# EAGLE design cigpack-batt_lm3622 (EAGLE 4.13)
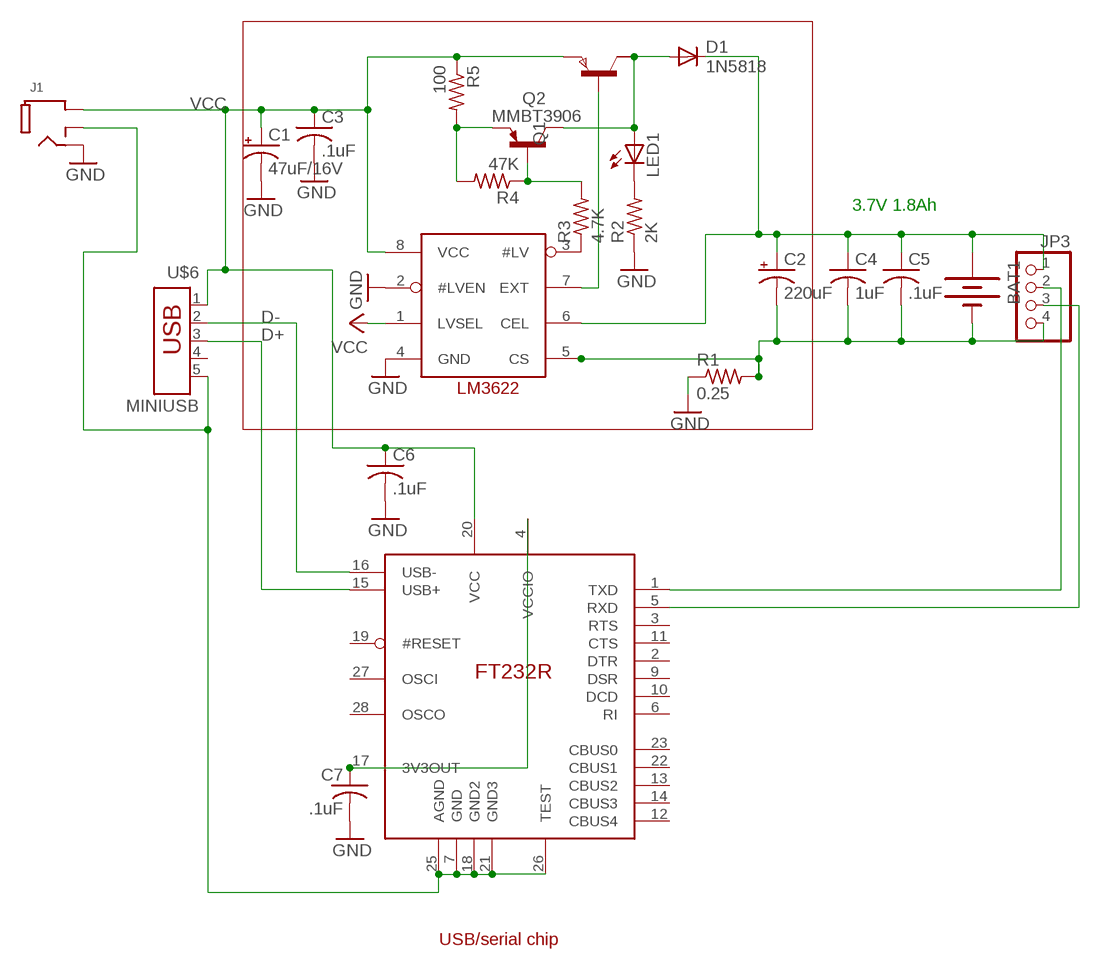
[diagram p0: schematic, sheet 1]

## Parts
BAT1  BATTERY  [LIPOLY-65X34MM]
C1  47uF/16V  CPOL-US153CLV-0605  [153CLV-0605]
C2  220uF  CPOL-US153CLV-0810  [153CLV-0810]
C3  .1uF  C-USC1206  [C1206]
C4  1uF  C-USC3225  [C3225]
C5  .1uF  C-USC1206  [C1206]
C6  .1uF  C-USC1206  [C1206]
C7  .1uF  C-USC1206  [C1206]
D1  1N5818  DIODE-SMB  [SMB]
IC1  LM3622  [SO08]
IC2  FT232R  [TSSOP28]
J1  CLEANAIR_POWERJACK163-2217  [CLEANAIR_5MMJACK]
JP3  PINHD-1X4  [1X04]
LED1  LEDSMT1206  [1206]
Q1  PNPSOT223  [SOT223]
Q2  MMBT3906  MMBT3906LT1SMD  [SOT23-BEC]
R1  0.25  R-US_M1206  [M1206]
R2  2K  R-US_R1206  [R1206]
R3  4.7K  R-US_R1206  [R1206]
R4  47K  R-US_R1206  [R1206]
R5  100  R-US_R1206  [R1206]
U$6  MINIUSB  [UX60A-MB-5SY]

## Nets
D+: IC2.15(USB+) U$6.3
D-: IC2.16(USB-) U$6.2
GND: C1.- C3.2 C6.2 C7.2 IC1.2(#LVEN) IC1.4(GND) J1.RING R1.1 R2.1
N$1: BAT1.- C2.- C4.2 C5.2 IC1.5(CS) JP3.4 R1.2
N$2: IC2.7(GND) IC2.18(GND2) IC2.21(GND3) IC2.25(AGND) IC2.26(TEST) J1.RING_SW U$6.5
N$3: LED1.C R2.2
N$4: IC1.3(#LV) R3.1
N$5: Q2.B R3.2 R4.1
N$6: Q2.E R4.2 R5.2
N$7: D1.A LED1.A Q1.4(C1) Q2.C
N$8: BAT1.+ C2.+ C4.1 C5.1 D1.C IC1.6(CEL) JP3.1
N$9: IC1.7(EXT) Q1.1(B)
N$10: IC2.1(TXD) JP3.2
N$17: C7.1 IC2.4(VCCIO) IC2.17(3V3OUT)
N$41: IC2.5(RXD) JP3.3
VCC: C1.+ C3.1 C6.1 IC1.1(LVSEL) IC1.8(VCC) IC2.20(VCC) J1.TIP Q1.3(E) R5.1 U$6.1
Unconnected: IC2.2(DTR) IC2.3(RTS) IC2.6(RI) IC2.9(DSR) IC2.10(DCD) IC2.11(CTS) IC2.12(CBUS4) IC2.13(CBUS2) IC2.14(CBUS3) IC2.19(#RESET) IC2.22(CBUS1) IC2.23(CBUS0) IC2.27(OSCI) IC2.28(OSCO) Q1.2(C) U$6.4

## Notes on the sheet
- 3.7V 1.8Ah
- USB/serial chip

## Library data of the parts
BAT1 = cleanair:BATTERY: BATTERY
C1 C2 = rcl:CPOL-US: POLARIZED CAPACITOR, American symbol
C3-C7 = rcl:C-US: CAPACITOR, American symbol
D1 = diode:DIODE-: DIODE
IC1 = liion:LM3622
IC2 = ft232:FT232R
J1 = cigpack-batt_lm3622:CLEANAIR_POWERJACK
JP3 = pinhead:PINHD-1X4: PIN HEADER
LED1 = led:LED: LED OSRAM: - CHIPLED LG R971, LG N971, LY N971, LG Q971, LY Q971, LO R971, LY R971 LH N974, LH R974 LS Q976, LO Q976, LY Q976 LO Q996 - Hyper CHIPLED LW Q18S LB Q993, LB Q99A, LB R99A - SideLED LS A670, LO A670, LY A670, LG A670, LP A670 LB A673, LV A673, LT A673, LW A673 LH A674 LY A675 LS A676, LA A676, LO A676, LY A676, LW A676 LS A679, LY A679, LG A679 - Hyper Micro SIDELED® LS Y876, LA Y876, LO Y876, LY Y876 LT Y87S - SmartLED LW L88C, LW L88S LB L89C, LB L89S, LG L890 LS L89K, LO L89K, LY L89K LS L896, LA L896, LO L896, LY L896 - TOPLED LS T670, LO T670, LY T670, LG T670, LP T670 LSG T670, LSP T670, LSY T670, LOP T670, LYG T670 LG T671, LOG T671, LSG T671 LB T673, LV T673, LT T673, LW T673 LH T674 LS T676, LA T676, LO T676, LY T676, LB T676, LH T676, LSB T676, LW T676 LB T67C, LV T67C, LT T67C, LS T67K, LO T67K, LY T67K, LW E67C LS E67B, LA E67B, LO E67B, LY E67B, LB E67C, LV E67C, LT E67C LW T67C LS T679, LY T679, LG T679 LS T770, LO T770, LY T770, LG T770, LP T770 LB T773, LV T773, LT T773, LW T773 LH T774 LS E675, LA E675, LY E675, LS T675 LS T776, LA T776, LO T776, LY T776, LB T776 LHGB T686 LT T68C, LB T68C - Hyper Mini TOPLED® LB M676 - Mini TOPLED Santana® LG M470 LS M47K, LO M47K, LY M47K Source: http://www.osram.convergy.de/
Q1 = zetex:PNPSOT223: PNP TRANSISTOR
Q2 = transistor-pnp:MMBT3906*: PNP Transistror
R1-R5 = rcl:R-US_: RESISTOR, American symbol
U$6 = cleanair:MINIUSB

## Board
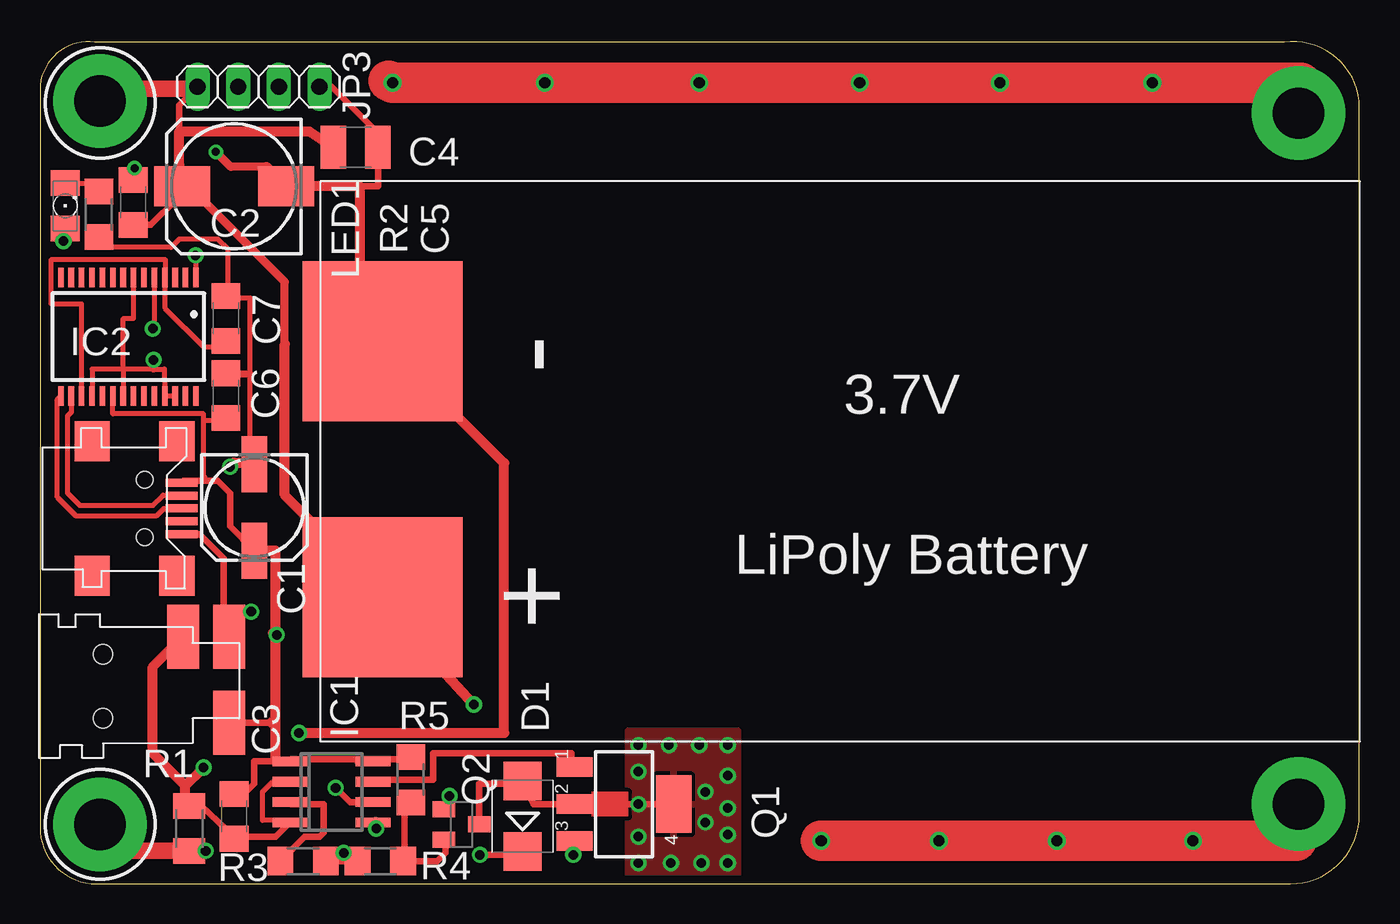
[diagram p1: board, top side]
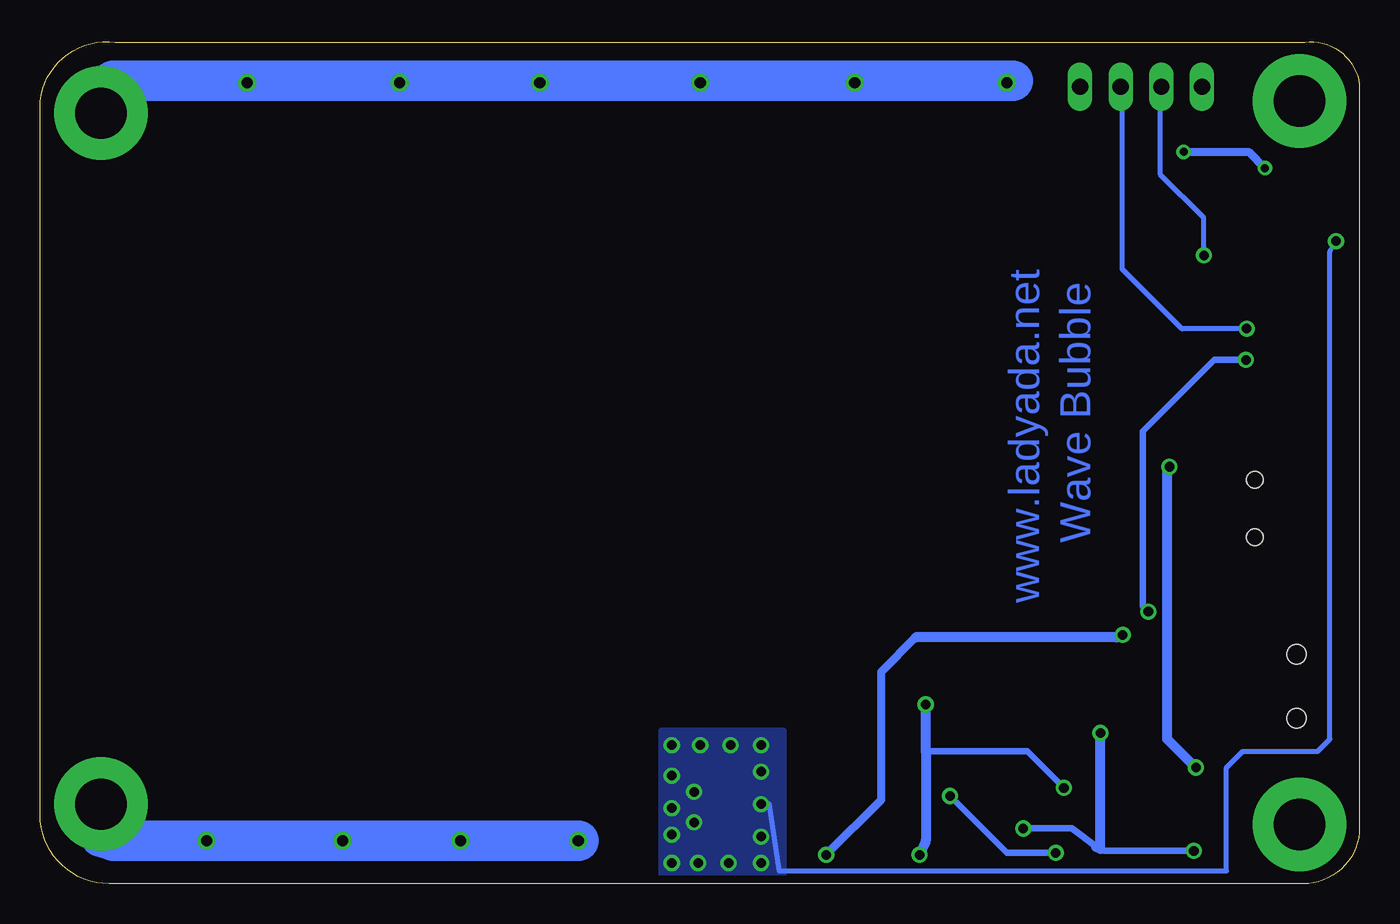
[diagram p2: board, bottom side, seen from below]

Size 82.49 x 52.63 mm. Coordinates in mm from the lower left corner, seen from the top.
Outline: 3.43,52.6 arc90 0,49.93 0,3.52 arc90 3.52,0 78.16,0 arc90 82.49,4.33 82.49,48.9 arc90 77.78,52.6 3.43,52.6
Copper layers (1*16): Top 0.035mm / dielectric 1.5mm / Bottom 0.035mm
Design rules "default": minimum track width 12mil, minimum drill 19mil, track to track 10mil, track to pad 10mil, pad to pad 10mil, via to via 10mil, smd to smd 1mil, copper to edge 20mil, drill to drill 8mil, minimum pad ring 10mil, minimum via ring 8mil, stop-mask expansion 4mil, vias tented up to drill 0mil, thermal gap 10mil

### Footprints (pad centres in the part's own frame; a part is rotated, then mirrored left to right if it is on the bottom)
LIPOLY-65X34MM = smd 10 x 10: + -8,28.11; - 8,28.11
153CLV-0605 = smd 3.5 x 1.6: + 2.7,0; - -2.7,0
153CLV-0810 = smd 3.5 x 2.5: + 3.25,0; - -3.25,0
C1206 = smd 1.6 x 1.8: 1 -1.4,0; 2 1.4,0
C3225 = smd 1.6 x 2.7: 1 -1.4,0; 2 1.4,0
SMB = smd 2.4 x 2.4: A 2.2,0; C -2.2,0
SO08 = smd 0.6 x 2.2: 1 -1.905,-2.6; 2 -0.635,-2.6; 3 0.635,-2.6; 4 1.905,-2.6; 5 1.905,2.6; 6 0.635,2.6; 7 -0.635,2.6; 8 -1.905,2.6
TSSOP28 = smd 0.35 x 1.2: 1 -4.225,-3.7; 2 -3.575,-3.7; 3 -2.925,-3.7; 4 -2.275,-3.7; 5 -1.625,-3.7; 6 -0.975,-3.7; 7 -0.325,-3.7; 8 0.325,-3.7; 9 0.975,-3.7; 10 1.625,-3.7; 11 2.275,-3.7; 12 2.925,-3.7; 13 3.575,-3.7; 14 4.225,-3.7; 15 4.225,3.7; 16 3.575,3.7; 17 2.925,3.7; 18 2.275,3.7; 19 1.625,3.7; 20 0.975,3.7; 21 0.325,3.7; 22 -0.325,3.7; 23 -0.975,3.7; 24 -1.625,3.7; 25 -2.275,3.7; 26 -2.925,3.7; 27 -3.575,3.7; 28 -4.225,3.7
CLEANAIR_5MMJACK = smd 2 x 4: RING -9,-2.596; RING_SW -11.9,-2.6; TIP -11.9,2.8 | hole 1.2: -4,2.5; -4,-1.5
1X04 = drill 1.016 long: 1 -3.81,0; 2 -1.27,0; 3 1.27,0; 4 3.81,0
1206 = smd 1.6 x 1.803: A -1.422,0; C 1.422,0
SOT223 = smd 1.219 x 2.235: 1 -2.311,-3.099; 2 0,-3.099; 3 2.311,-3.099 | smd 3.6 x 2.2: 4 0,3.099
SOT23-BEC = smd 1 x 1.4: B -0.95,-1.1; C 0,1.1; E 0.95,-1.1
M1206 = smd 1.6 x 2: 1 -1.4,0; 2 1.4,0
R1206 = smd 1.6 x 1.803: 1 -1.422,0; 2 1.422,0
UX60A-MB-5SY = smd 0.5 x 2: 1 -1.6,2.3; 2 -0.8,2.3; 3 0,2.3; 4 0.8,2.3; 5 1.6,2.3 | smd 2.5 x 2.2: C1 -4.2,2; C2 -4.2,-3.3; C3 4.2,-3.3; C4 4.2,2 | hole 1.016: -1.8,0; 1.8,0

### Placement (x,y rotation side)
BAT1  49.52,25.9 90 top
C1  13.4,23.52 270 top
C2  12.13,43.59 180 top
C3  12.13,4.22 270 top
C4  19.73,46.02 0 top
C5  5.84,42.58 90 top
C6  11.63,30.5 90 top
C7  11.63,35.33 90 top
D1  30.17,4.22 90 top
IC1  18.23,5.74 270 top
IC2  5.53,34.19 180 top
J1  -0.06,12.85 180 top
JP3  13.66,49.81 0 top
LED1  1.58,42.37 90 top
Q1  36.52,4.98 270 top
Q2  26.36,3.71 270 top
R1  9.34,3.45 270 top
R2  3.68,41.84 90 top
R3  16.45,1.42 0 top
R4  21.28,1.42 0 top
R5  23.18,6.5 270 top
U$6  6.56,23.46 270 top

### Tracks (layer width: path | path; a pad name or v marks a point on that pad's centre or on a via)
19GHZANT  (via drill 0.7, 3.2 pad 5.84)
  Top 0.305: 78.68,3.83 78.81,3.96 | 78.68,3.83 78.55,3.83 78.55,2.69 | 78.68,3.83 v78.68,4.98
  Top 2.54: v48.84,2.69 52.39,2.69 v56.2,2.69 59.89,2.69 v63.57,2.69 67.76,2.69 v72.08,2.69 78.55,2.69
  Bottom 2.54: v48.84,2.69 52.39,2.69 v56.2,2.69 59.89,2.69 v63.57,2.69 67.76,2.69 v72.08,2.69 77.92,2.69 78.68,2.95 v78.68,4.98
800MHZANT  (via drill 0.7, 3.2 pad 5.84)
  Top 0.305: 78.81,50.06 79.44,49.43 v78.68,48.16
  Top 0.406: 73.6,50.19 73.35,50.44 72.97,50.06 v69.54,50.06
  Top 2.54: 21.79,50.19 v22.04,50.06 26.61,50.06 v31.57,50.06 38.04,50.06 v41.22,50.06 46.93,50.06 v51.25,50.06 55.95,50.06 v60.01,50.06 64.84,50.06 v69.54,50.06 78.81,50.06
  Bottom 2.54: v78.68,48.16 78.68,49.81 77.92,50.19 21.66,50.19
D+
  Top 0.305: U$6.3 7.75,23.46 7.31,23.01 2.23,23.01 1.08,24.16 1.08,30.25 1.3,30.47 IC2.15
D-
  Top 0.305: IC2.16 1.97,30.51 1.97,29.49 1.72,29.23 1.72,24.41 2.48,23.65 7.05,23.65 7.69,24.28 8.71,24.28 8.73,24.26 U$6.2
GND  (via drill 0.6)
  Top 0.305: IC1.2 14.55,6.38 13.91,5.74 13.91,3.96 15.63,3.96 | 15.63,3.96 15.69,3.96 | IC1.4 15.63,3.96 | R2.1 3.69,40.28 3.69,39.84 4.01,39.78 8.2,39.78 8.71,40.28 11.12,40.28 11.75,39.65 11.75,36.35 | 11.75,36.35 C7.2 11.75,36.6 13.15,36.6 13.15,31.9 | 11.75,36.35 11.75,36.22 | 13.15,31.9 13.15,31.77 12.01,31.77 C6.2 13.15,31.9 | C1.- 13.15,26.47 13.15,31.9 | 13.15,31.9
  Top 0.406: R1.1 10.11,4.85 12.13,2.95 | 12.13,2.95 C3.2 | IC1.4 14.74,2.95 12.13,2.95 | C1.- 13.4,26.06
  Top 0.61: C1.- 13.4,26.31 12.13,26.31 v11.88,26.06 | 9.09,6.12 7.05,8.15 7.05,13.56 8.9,15.4 8.98,15.4 | R1.1 9.09,4.85 9.09,6.12 | 9.09,6.12 v10.23,7.26 | 8.98,15.4 9.09,15.4 | 8.98,15.4 J1.RING
  Bottom 0.61: v11.88,26.06 12.01,25.93 12.01,9.05 12.02,9.04 12.01,9.04 v10.23,7.26
N$1  (via drill 0.5, 0.6, 3.2 pad 5.84)
  Top 0.406: R1.2 9.21,2.06 v10.36,2.06 | IC1.5 20.96,3.96 21.02,3.96 v21.02,3.45 | 20.01,43.59 21.15,43.59 21.15,46.02 C4.2 21.13,46.11 21.15,46.13 21.15,46.89 18.23,49.81 JP3.4
  Top 0.508: 14.17,44.8 11.93,44.8 v10.99,45.75 | C5.2 5.96,44.65 5.78,44.48 v5.91,44.73
  Top 0.61: 21.28,34.06 21.28,34.03 BAT1.- 29.02,26.29 29.02,9.42 v16.2,9.42 | 21.28,34.06 20.01,34.06 20.01,43.59 C2.- 14.17,44.8 | 21.28,34.06 22.68,34.06
  Top 1.016: 3.5,3.71 3.5,3.96 | 3.5,3.71 v3.75,3.71 | R1.2 3.5,2.05 3.5,3.71
  Bottom 0.406: v10.36,2.06 15.94,2.06 16.45,2.31 17.98,3.45 v21.02,3.45
  Bottom 0.508: v10.99,45.75 6.93,45.75 v5.91,44.73
  Bottom 0.61: 16.45,2.31 16.2,2.18 v16.2,9.42
N$2  (via drill 0.6)
  Top 0.305: 7.94,30.49 IC2.25 7.77,32.16 7.07,32.16 5.15,32.16 | 7.94,30.49 IC2.26 | 7.94,30.49 7.94,30.5 | 5.21,32.16 IC2.21 | 5.21,32.16 5.21,35.33 5.86,35.33 IC2.7 | IC2.18 3.26,32.16 5.15,32.16 | 5.15,32.16 5.21,32.16 | J1.RING_SW 12.1,15.71 12.1,16.89 12.17,16.97 13.2,16.97 v13.2,17
  Top 0.406: U$6.5 9.99,21.86 11.49,20.36 11.49,15.98 11.71,15.75 | J1.RING_SW 11.71,15.44 11.71,15.75 | v7.11,32.74 7.07,32.16 | v13.2,17 13.24,16.97 13.24,16.93 12.9,16.93 11.71,15.75
  Bottom 0.406: v13.2,17 13.54,17.35 13.54,28.28 9.09,32.74 v7.11,32.74
N$3
  Top 0.305: R2.2 3.7,43.39 3.62,43.71 3.83,43.79 LED1.C
N$4
  Top 0.406: R3.1 16.55,2.95 17.47,2.95 17.72,3.2 17.72,4.98 15.69,4.98 15.69,5.04 IC1.3
N$5  (via drill 0.6)
  Top 0.406: 17.47,1.68 R3.2 18.74,1.42 | 18.74,1.42 R4.1 | Q2.B 25.6,5 v25.6,5.49 | v18.99,1.93 18.74,1.68 18.74,1.42
  Bottom 0.406: v25.6,5.49 22.04,1.93 v18.99,1.93
N$6
  Top 0.406: R5.2 22.9,4.72 22.8,4.72 22.8,2.29 R4.2 | R4.2 22.45,1.42 | R4.2 24.83,1.42 25.34,1.93 25.34,2.69 25.32,2.69 Q2.E
N$7  (via drill 0.6)
  Top 0.305: LED1.A 1.47,41.34 v1.47,40.16
  Top 0.406: D1.A 30.84,4.98 Q1.4 | D1.A 29.24,6.25 28.05,6.25 | D1.A 30.17,6.25 27.46,6.25 Q2.C
  Bottom 0.305: v1.47,40.16 1.85,39.52 1.85,9.04 2.61,8.28 7.31,8.28 8.32,7.26 8.32,0.79 36.26,0.79 36.9,4.98
  other vias: 42.99,8.66 41.22,8.66 39.31,8.66 37.41,8.66 42.99,6.76 42.99,4.72 42.99,1.29 42.99,3.07 41.34,1.29 39.44,1.29 37.41,1.29 37.41,4.98 41.6,5.74 41.6,3.83 37.41,7.01 37.41,2.95
  pour Top: 36.77,0.41 36.77,9.55 43.63,9.55 43.63,0.41
  pour Bottom: 43.63,0.41 43.63,9.55 36.01,9.55 36.01,0.41
N$8  (via drill 0.6, 3.2 pad 5.84)
  Top 0.406: D1.C 29.45,1.8 v27.5,1.8 | IC1.6 19.37,5.1 v18.48,5.99 | C2.+ 8.58,42.82 6.93,41.18 C5.1 | JP3.1 8.71,48.67 8.71,47.02
  Top 0.508: C2.+ 9.34,43.59 15.31,37.62 15.31,33.73
  Top 0.61: v27.12,11.2 20.93,17.93 BAT1.+ 21.28,18.03 21.28,18.31 15.31,24.28 15.31,33.73 | C2.+ 8.71,44.93 8.71,47.02 16.83,47.02 C4.1
  Top 1.016: JP3.1 9.72,49.68 4.51,49.68 v3.75,48.92
  Bottom 0.406: v18.48,5.99 20.77,8.28 27.12,8.28
  Bottom 0.61: v27.5,1.8 27.12,2.69 27.12,8.28 v27.12,11.2
N$9
  Top 0.406: IC1.7 20.2,6.5 24.58,6.5 24.58,8.15 33.22,8.15 33.22,7.26 33.39,7.26 Q1.1
N$10  (via drill 0.6)
  Top 0.305: IC2.1 9.76,38.85 v9.72,39.27
  Bottom 0.305: v9.72,39.27 9.75,41.63 12.44,44.32 12.44,49.86 | 12.44,49.92 12.44,49.86 | 12.44,49.86 JP3.2
N$17
  Top 0.305: C7.1 11.75,33.55 10.23,33.55 7.81,35.98 IC2.4 7.81,38.24 7.82,38.25 7.82,39.01 0.7,39.01 0.7,36.22 2.6,36.22 IC2.17
N$41  (via drill 0.6)
  Top 0.305: IC2.5 7.16,37.89 7.18,34.57 v7.05,34.7
  Bottom 0.305: v7.05,34.7 11.09,34.67 14.84,38.42 14.84,49.73 14.85,49.73 JP3.3
VCC  (via drill 0.6)
  Top 0.305: 10.23,25.17 10.23,28.98 | 10.23,28.98 10.23,29.36 4.56,29.36 4.55,29.36 | 10.23,28.98 11.83,28.98 | 11.83,28.98 12,28.98 | 4.55,29.36 4.55,29.35 | IC2.20 4.55,29.36 | 9.09,25.17 9.09,25.16 8.96,25.16 U$6.1 | 11.83,28.98 11.83,29.12 11.64,29.12 C6.1
  Top 0.406: 19.75,7.71 19.75,7.77 22.7,7.77 R5.1 | 19.75,7.71 IC1.8 | C3.1 12.26,5.74 12.9,5.74 13.4,6.25 13.4,7.64 14.72,7.64 IC1.1 arc90 15.69,7.71 15.69,7.77 19.69,7.77 arc-90 19.75,7.71 | 10.29,25.23 10.23,25.17 9.09,25.17 8.97,25.17 | 10.29,25.23 10.23,25.43 | C1.+ 11.88,22.34 11.88,24.41 11.12,25.17 10.36,25.17 10.29,25.23 | J1.TIP 11.86,10.07 14.46,10.07 14.5,10.11
  Top 0.508: Q1.3 33.34,2.59 v33.34,1.8
  Top 0.61: C1.+ 14.72,20.82 14.72,15.67 | 14.72,7.64 14.72,10.11 | 14.72,10.11 14.72,15.67 | 14.72,10.11 14.5,10.11 14.5,10.05 | 14.72,15.67 14.57,15.67 14.69,15.56 v14.8,15.56
  Bottom 0.508: v33.34,1.8 29.91,5.23 29.91,13.23 27.75,15.39
  Bottom 0.61: 27.75,15.39 15.2,15.39 v14.8,15.56
(copper drawn outside any net)
  shapes: Top area x1

### Text on the board
Bottom: Wave Bubble | www.ladyada.net